# EAGLE schematic GWLSensorv3 (EAGLE 9.5.2)
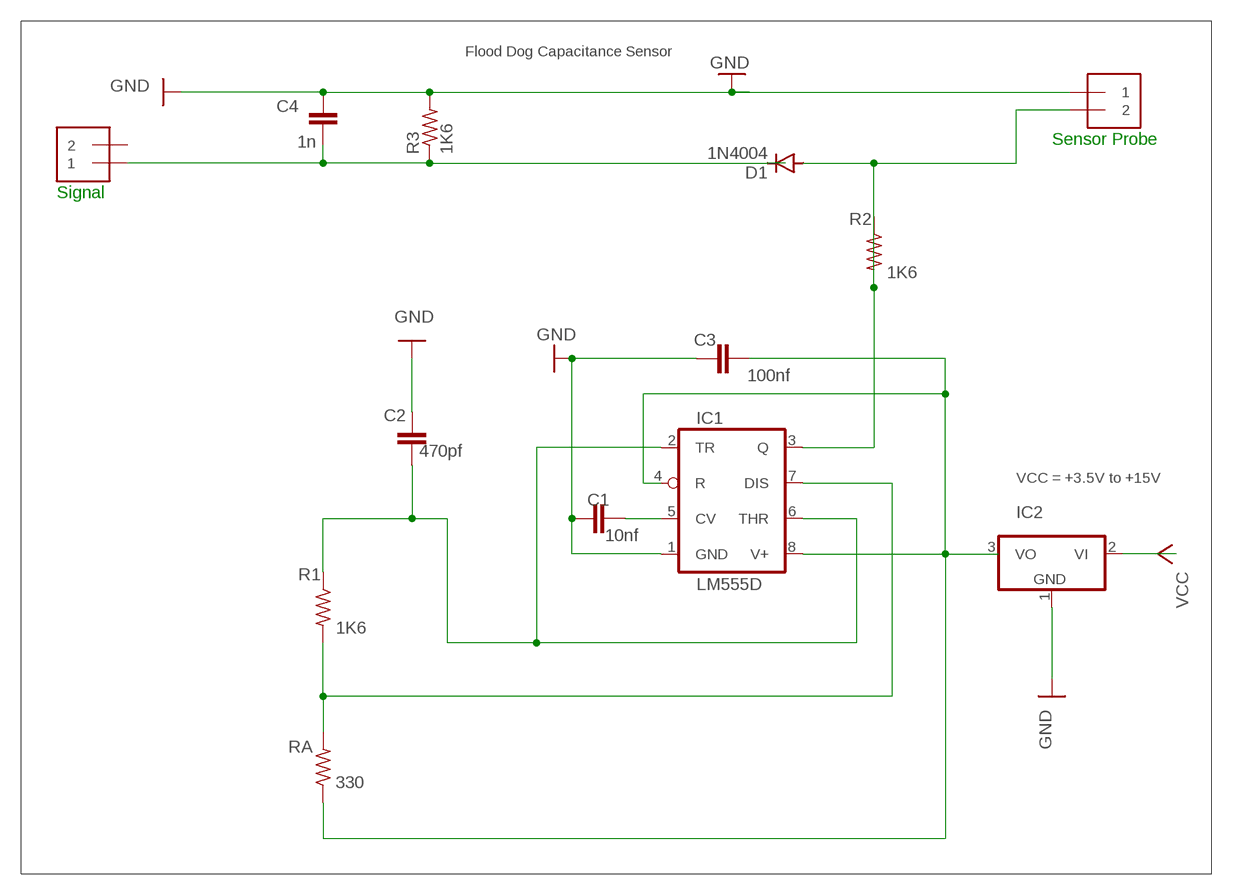
[diagram p0: schematic, sheet 1]

## Parts
C1  10nf  C-EUC0805  [C0805]
C2  470pf  C-EUC0805  [C0805]
C3  100nf  C-EUC0805  [C0805]
C4  1n  C-EUC0805  [C0805]
D1  1N4004  [DO41-10]
IC1  LM555D  [SO08]
IC2  79L15Z  [TO92]
PROBE  1X2-3.5MM  [1X2-3.5MM]
R1  1K6  R-US_R0805  [R0805]
R2  1K6  R-US_R0805  [R0805]
R3  1K6  R-US_R0805  [R0805]
RA  330  R-US_R0805  [R0805]
SIGNAL  1X2-3.5MM  [1X2-3.5MM]

## Nets
GND: C1.1 C2.1 C3.1 C4.2 IC1.1(GND) IC2.1(GND) PROBE.1 R3.2
N$1: C4.1 D1.C R3.1 SIGNAL.1
N$2: C2.2 IC1.2(TR) IC1.6(THR) R1.1
N$3: IC1.7(DIS) R1.2 RA.2
N$4: C1.2 IC1.5(CV)
N$5: D1.A IC1.3(Q) PROBE.2 R2.1 R2.2
N$6: C3.2 IC1.4(R) IC1.8(V+) IC2.3(VO) RA.1
VCC: IC2.2(VI)
Unconnected: SIGNAL.2

## Notes on the sheet
- Flood Dog Capacitance Sensor
- Sensor Probe
- Signal
- VCC = +3.5V to +15V

## Library data of the parts
C1-C4 = rcl:C-EU: CAPACITOR, European symbol
D1 = diode:1N4004: DIODE general purpose rectifier, 1 A
IC1 = linear:*555: TIMER
IC2 = linear:79*: Negative VOLTAGE REGULATOR
PROBE SIGNAL = adafruit:1X2: 3.5mm Terminal block http://www.ladyada.net/library/pcb/eaglelibrary.html
R1-R3 RA = rcl:R-US_: RESISTOR, American symbol